# Altium schematic sheet EFVH100ADA101M10C01_EFVH100ADA101M10C0.schdoc
size 127 x 99 mm
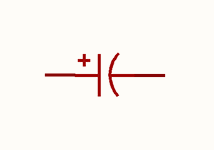
[diagram p0: EFVH100ADA101M10C01_EFVH100ADA101M10C0.schdoc]

## Parts
U?  100uF  [CAP-SMD_BD10.0-L10.3-W10.3-FD]  (value not drawn)

## Nets

Not connected (* = marked no-connect by the designer): U? 1 2

## Library data of the parts
U? = EFVH100ADA101M10C0: Manufacturer: FOLLON(富隆电子); Add into BOM: yes; Tolerance: ±20%; Voltage Rating: 100V; Symbol: EFVH100ADA101M10C0; Device: EFVH100ADA101M10C0; LCSC Part Name: 100uF ±20% 100V; Supplier Part: C22387799; Manufacturer Part: EFVH100ADA101M10C0; Supplier Footprint: SMD,D10xL12.5mm; JLCPCB Part Class: Extended Part; Datasheet: https://item.szlcsc.com/datasheet/EFVH100ADA101M10C0/23952399.html; Supplier: LCSC; Convert to PCB: yes; Value: 100uF; Diameter: 10mm; Height - Seated (Max): 12.5mm; Operating Temperature: -55℃~+105℃